# Altium project PinBoardJTAG20_10.PrjPcb
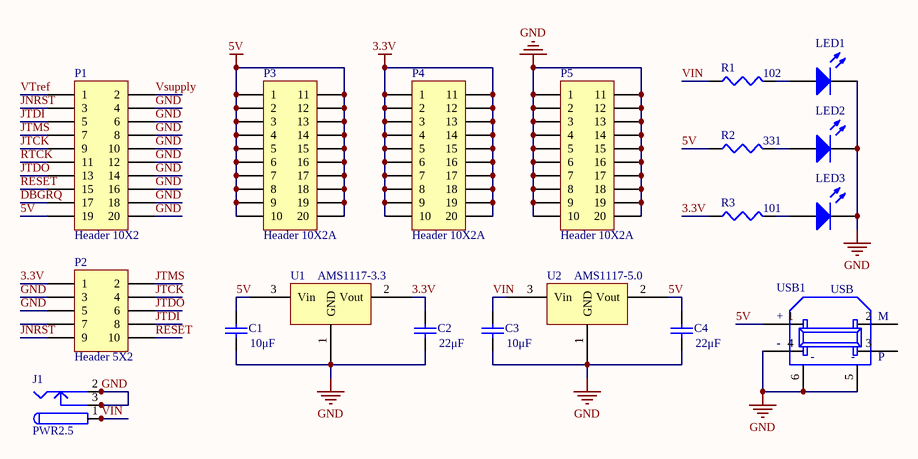
[diagram p0: PinBoardJTAG20_10.SchDoc]
1 sheet, 19 parts. Net scope: global (net labels, ports and power ports of the same name join across sheets).
Board file: PinBoardJTAG20_10.PcbDoc

## Sheet PinBoardJTAG20_10.SchDoc
size A4

### Parts
C1  value 10μF  [1608[0603]]  (hidden comment: Cap Semi)
C2  value 22μF  [1608[0603]]  (hidden comment: Cap Semi)
C3  value 10μF  [1608[0603]]  (hidden comment: Cap Semi)
C4  value 22μF  [1608[0603]]  (hidden comment: Cap Semi)
J1  PWR2.5  [KLD-0202]
LED1  LED1  [BAT-2]  (value not drawn)
LED2  LED1  [BAT-2]  (value not drawn)
LED3  LED1  [BAT-2]  (value not drawn)
P1  Header 10X2  [HDR2X10]
P2  Header 5X2  [HDR2X5]
P3  Header 10X2A  [HDR2X10_CEN]
P4  Header 10X2A  [HDR2X10_CEN]
P5  Header 10X2A  [HDR2X10_CEN]
R1  value 102  [6-0805_N]  (hidden comment: Res3)
R2  value 331  [6-0805_N]  (hidden comment: Res3)
R3  value 101  [6-0805_N]  (hidden comment: Res3)
U1  AMS1117-3.3  [AMS1117-SOT223]
U2  AMS1117-5.0  [AMS1117-SOT223]
USB1  USB  [MICROUSB_D2S6]

### Nets
3.3V: C2.2 P2.1 P4.1 P4.2 P4.3 P4.4 P4.5 P4.6 P4.7 P4.8 P4.9 P4.10 P4.11 P4.12 P4.13 P4.14 P4.15 P4.16 P4.17 P4.18 P4.19 P4.20 R3.1 U1.2(Vout)
5V: C1.2 C4.2 P1.19 P3.1 P3.2 P3.3 P3.4 P3.5 P3.6 P3.7 P3.8 P3.9 P3.10 P3.11 P3.12 P3.13 P3.14 P3.15 P3.16 P3.17 P3.18 P3.19 P3.20 R2.1 U1.3(Vin) U2.2(Vout) USB1.1(VB)
GND: C1.1 C2.1 C3.1 C4.1 J1.2 J1.2A J1.2B J1.3 J1.3A J1.3B LED1.2(K) LED2.2(K) LED3.2(K) P1.4 P1.6 P1.8 P1.10 P1.12 P1.14 P1.16 P1.18 P1.20 P2.3 P2.5 P5.1 P5.2 P5.3 P5.4 P5.5 P5.6 P5.7 P5.8 P5.9 P5.10 P5.11 P5.12 P5.13 P5.14 P5.15 P5.16 P5.17 P5.18 P5.19 P5.20 U1.1(GND) U2.1(GND) USB1.4(G) USB1.5(G) USB1.6(G)
DBGRQ: P1.17
JNRST: P1.3 P2.9
JTCK: P1.9 P2.4
JTDI: P1.5 P2.8
JTDO: P1.13 P2.6
JTMS: P1.7 P2.2
RESET: P1.15 P2.10
RTCK: P1.11
VIN: C3.2 J1.1 J1.1A J1.1B R1.1 U2.3(Vin)
Vsupply: P1.2
VTref: P1.1
NetLED1_1: LED1.1(A) R1.2
NetLED2_1: LED2.1(A) R2.2
NetLED3_1: LED3.1(A) R3.2

Not connected (* = marked no-connect by the designer): P2 7; USB1 2(DM) 3(DP)

### Notes on the sheet
- (in symbol USB) +; M; -; P

### Library data of the parts
C1-C4 = Cap Semi: Capacitor (Semiconductor SIM Model); Published: 8-Jun-2000; LatestRevisionDate: 29-May-2009; LatestRevisionNote: IPC-7351 Footprint Added.; PackageReference: C1206; Publisher: Altium Limited; PackageDescription: Chip Capacitor
J1 = PWR2.5: Low Voltage Power Supply Connector; Published: 17-Dec-2003; DatasheetDocument: 09-May-2002; Publisher: Altium Limited; ComponentLink1Description: Manufacturer Link; ComponentLink1URL: http://domino.kycon.com/internet/Products.html
LED1-LED3 = LED1: Typical RED GaAs LED; Published: 8-Jun-2000; LatestRevisionDate: 08-Jul-2005; LatestRevisionNote: Mech Layer 1 removed.; PackageReference: LED-1; Publisher: Altium Limited; PackageDescription: LED; 2 Leads
P1 = Header 10X2: Header, 10-Pin, Dual row; LatestRevisionDate: 17-Jul-2002; LatestRevisionNote: Re-released for DXP Platform.; Publisher: Altium Limited
P2 = Header 5X2: Header, 5-Pin, Dual row; LatestRevisionDate: 17-Jul-2002; LatestRevisionNote: Re-released for DXP Platform.; Publisher: Altium Limited
P3-P5 = Header 10X2A: Header, 10-Pin, Dual row; LatestRevisionDate: 17-Jul-2002; LatestRevisionNote: Re-released for DXP Platform.; Publisher: Altium Limited
R1-R3 = Res3: Resistor; Published: 8-Jun-2000; LatestRevisionDate: 29-May-2009; LatestRevisionNote: IPC-7351 Footprint Added.; PackageReference: J1-0603; Publisher: Altium Limited; PackageDescription: Chip Resistor